# Altium schematic sheet ADC.SchDoc
size OrCAD A
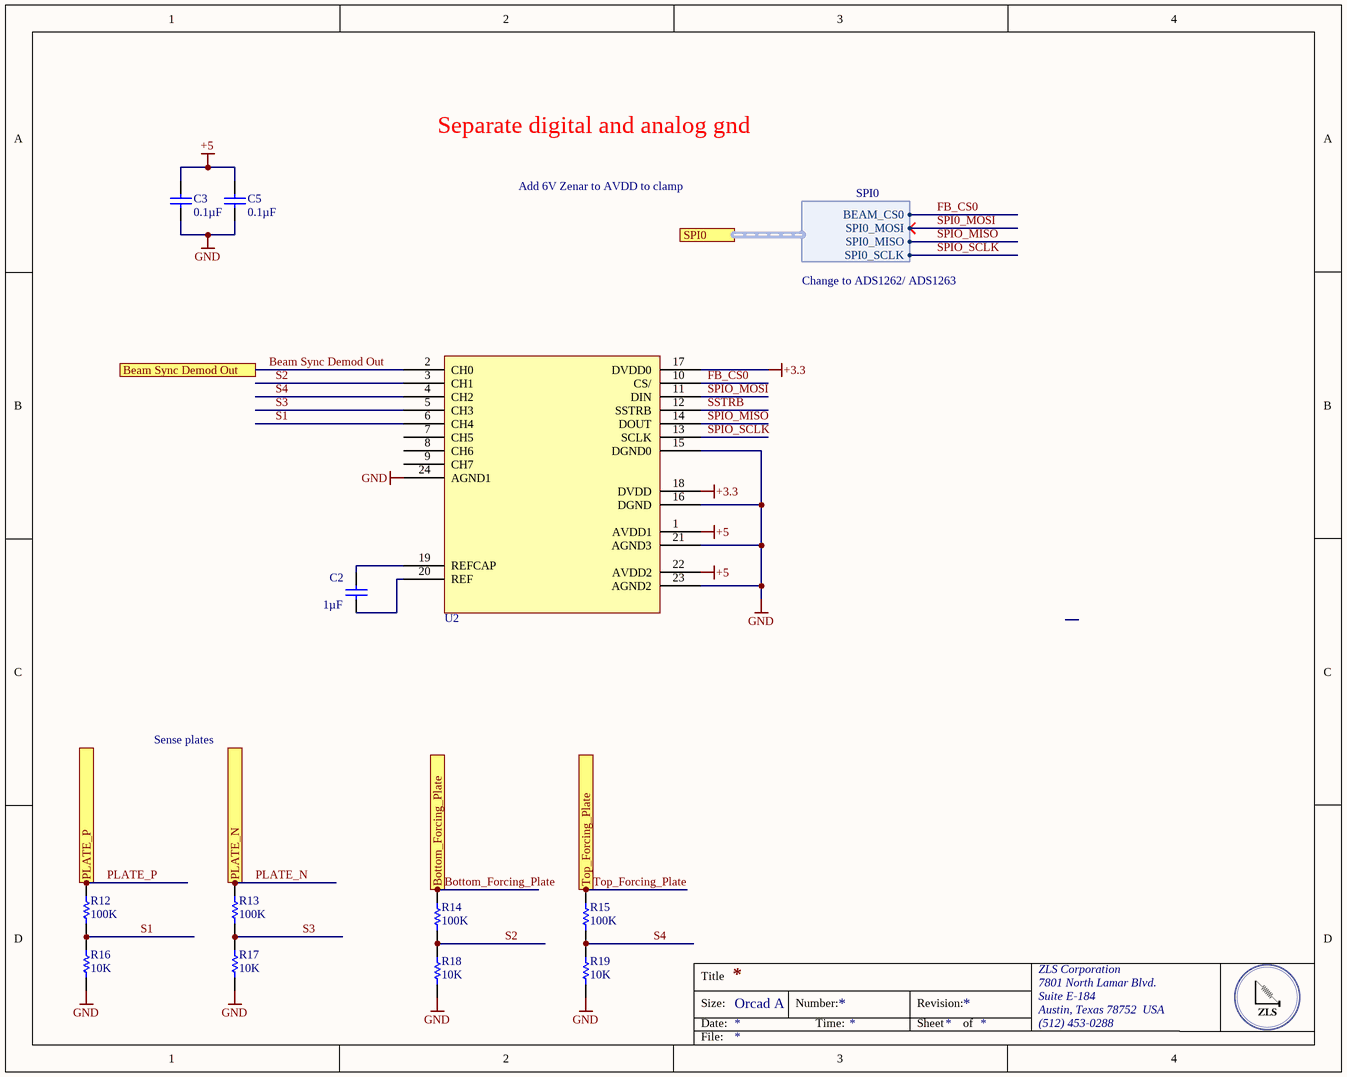
[diagram p0: ADC.SchDoc]

## Parts
C2  Capacitance: 1µF  [CAPC0805(2012)145_N]  (hidden comment: CAP CER 0.1UF 25V X7R 0805)
C3  Capacitance: 0.1µF  [CAPC0805(2012)145_N]  (hidden comment: CAP CER 0.1UF 25V X7R 0805)
C5  Capacitance: 0.1µF  [CAPC0805(2012)145_N]  (hidden comment: CAP CER 0.1UF 25V X7R 0805)
R12  100K  [RESC0402(1005)_M]
R13  100K  [RESC0402(1005)_M]
R14  100K  [RESC0402(1005)_M]
R15  100K  [RESC0402(1005)_M]
R16  10K  [RESC0402(1005)_M]
R17  10K  [RESC0402(1005)_M]
R18  10K  [RESC0402(1005)_M]
R19  10K  [RESC0402(1005)_M]
U2  MAX1300  [MAX1300]  (value not drawn)

## Ports
Beam Sync Demod Out, Bottom_Forcing_Plate, PLATE_N, PLATE_P, SPI0 (harness SPI0), Top_Forcing_Plate

## Harnesses
SPI0: BEAM_CS0, SPI0_MOSI, SPI0_MISO, SPI0_SCLK

## Nets
+3.3: U2.17(DVDD0) U2.18(DVDD)
+5: C3.2 C5.2 U2.1(AVDD1) U2.22(AVDD2)
GND: C3.1 C5.1 R16.1 R17.1 R18.1 R19.1 U2.15(DGND0) U2.16(DGND) U2.21(AGND3) U2.23(AGND2) U2.24(AGND1)
Beam Sync Demod Out: U2.2(CH0) ; port Beam Sync Demod Out
Bottom_Forcing_Plate: R14.2 ; port Bottom_Forcing_Plate
FB_CS0: U2.10(CS/) ; port SPI0.BEAM_CS0
PLATE_N: R13.2 ; port PLATE_N
PLATE_P: R12.2 ; port PLATE_P
S1: R12.1 R16.2 U2.6(CH4)
S2: R14.1 R18.2 U2.3(CH1)
S3: R13.1 R17.2 U2.5(CH3)
S4: R15.1 R19.2 U2.4(CH2)
SPI0_MOSI: port SPI0.SPI0_MOSI
SPIO_MISO: U2.14(DOUT) ; port SPI0.SPI0_MISO
SPIO_MOSI: U2.11(DIN)
SPIO_SCLK: U2.13(SCLK) ; port SPI0.SPI0_SCLK
SSTRB: U2.12(SSTRB)
Top_Forcing_Plate: R15.2 ; port Top_Forcing_Plate
NetC2_1: C2.1 U2.19(REFCAP)
NetC2_2: C2.2 U2.20(REF)

Not connected (* = marked no-connect by the designer): U2 7(CH5) 8(CH6) 9(CH7)

## Notes on the sheet
- Separate digital and analog gnd
- Add 6V Zenar to AVDD to clamp
- Change to ADS1262/ ADS1263
- Sense plates
- Title
- Size:
- Date:
- Orcad A
- Number:
- Time:
- Revision:
- Sheet
- of
- ZLS Corporation
- 7801 North Lamar Blvd.
- Suite E-184
- Austin, Texas 78752  USA
- (512) 453-0288
- File:

## Library data of the parts
C2 C3 C5 = CMP-1036-04795-1: Manufacturer: Murata Electronics North America; Manufacturer Part Number: GRM21BR71E104KA01L; Tolerance: ±10%; Supplier 1: Digi-Key; Supplier Part Number 1: 490-1673-6-ND; RoHS: RoHS Compliant; Category: Capacitors; Stock 1: 891652; Pricing 1: 1=0.2, 10=0.145, 100=0.0683, 500=0.04788, 1000=0.03964 (USD); Packaging: Digi-Reel®; Part Status: Active; Voltage - Rated: 25V; Temperature Coefficient: X7R; Operating Temperature: -55°C ~ 125°C; Features: -; Ratings: -; Applications: General Purpose; Mounting Type: Surface Mount, MLCC; Package / Case: 0805 (2012 Metric); Size / Dimension: 0.079" L x 0.049" W (2.00mm x 1.25mm); Height - Seated (Max): -; Thickness (Max): 0.053" (1.35mm); Lead Spacing: -; Lead Style: -; ComponentLink1URL: http://www.murata.com/~/media/webrenewal/support/library/catalog/products/capacitor/mlcc/c02e.ashx; ComponentLink1Description: http://www.murata.com/~/media/webrenewal/support/library/catalog/products/capacitor/mlcc/c02e.ashx
R12-R19 = CMP-1011-00463-1